# Altium schematic sheet IST8310.SchDoc
size A4
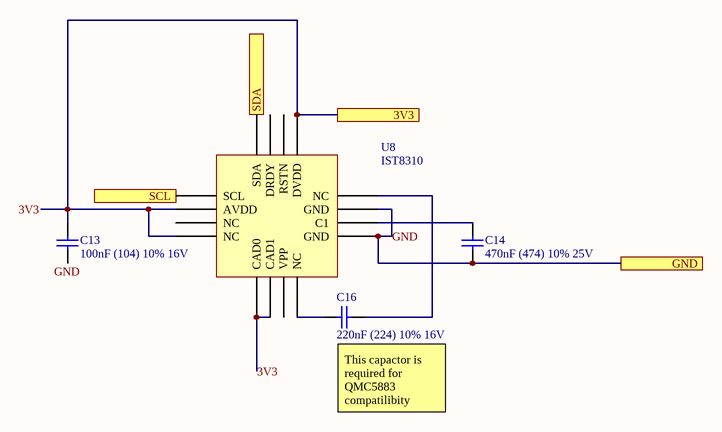
[diagram p0: IST8310.SchDoc]

## Parts
C13  100nF (104) 10% 16V  [0402_C]
C14  470nF (474) 10% 25V  [0603_C]
C16  220nF (224) 10% 16V  [0402_C]
U8  IST8310  [IST8310_LGA16]

## Ports
3V3, GND, SCL, SDA

## Nets
3V3: C13.1 U8.2(AVDD) U8.4(NC) U8.5(CAD0) U8.6(CAD1) U8.13(DVDD) ; port 3V3
GND: C13.2 C14.1 U8.9(GND) U8.11(GND) ; port GND
SCL: U8.1(SCL) ; port SCL
SDA: U8.16(SDA) ; port SDA
NetC14_2: C14.2 U8.10(C1)
NetC16_1: C16.1 U8.12(NC)
NetC16_2: C16.2 U8.8(NC)

Not connected (* = marked no-connect by the designer): U8 3(NC) 7(VPP) 14(RSTN) 15(DRDY)

## Notes on the sheet
- (near C16) This capactor is required for QMC5883 compatilibity

## Library data of the parts
C13 = 0402 100nF (104) 10% 16V: 贴片电容; ComponentLink1Description: 供应商链接; ComponentLink1URL: http://www.szlcsc.com/product/details_1877.html; Package: 0402; Supplier: LC; SuppliersPartNumber: C1525
C14 = 0603 470nF (474) 10% 25V: 贴片电容; ComponentLink1Description: 供应商链接; ComponentLink1URL: http://www.szlcsc.com/product/details_1975.html; Package: 0603; Supplier: LC; SuppliersPartNumber: C1623
C16 = 0402 220nF (224) 10% 16V: 贴片电容; ComponentLink1Description: 供应商链接; ComponentLink1URL: http://www.szlcsc.com/product/details_17456.html; Package: 0402; Supplier: LC; SuppliersPartNumber: C16772